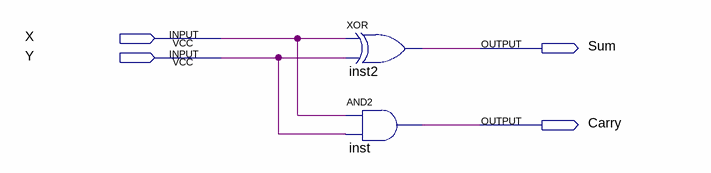
[diagram p0: schematic sheet]
// Quartus schematic Half_adder_test.bdf as structural Verilog: 2 symbols, 4 pins
module Half_adder_test (
  input  X,
  input  Y,
  output Sum,
  output Carry
);

  xor inst2 (Sum, X, Y);
  and inst (Carry, X, Y);
endmodule
